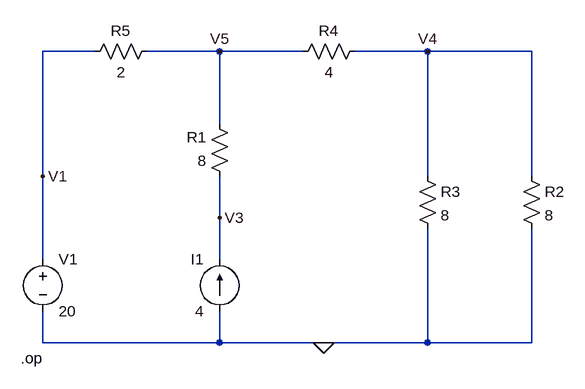
[diagram p0: schematic T2.asc]
T2.asc, the LTspice schematic file:
Version 4
SHEET 1 1048 680
WIRE 0 48 -80 48
WIRE 192 48 80 48
WIRE 320 48 192 48
WIRE 512 48 400 48
WIRE 672 48 512 48
WIRE 192 160 192 48
WIRE -80 240 -80 48
WIRE 512 240 512 48
WIRE 672 240 672 48
WIRE 192 304 192 240
WIRE -80 368 -80 240
WIRE 192 368 192 304
WIRE -80 496 -80 448
WIRE 192 496 192 448
WIRE 192 496 -80 496
WIRE 352 496 192 496
WIRE 512 496 512 320
WIRE 512 496 352 496
WIRE 672 496 672 320
WIRE 672 496 512 496
FLAG 352 496 0
FLAG 192 304 V3
FLAG 512 48 V4
FLAG 192 48 V5
FLAG -80 240 V1
SYMBOL res 208 256 R180
WINDOW 0 36 76 Left 2
WINDOW 3 36 40 Left 2
SYMATTR InstName R1
SYMATTR Value 8
SYMBOL res 656 224 R0
SYMATTR InstName R2
SYMATTR Value 8
SYMBOL res 496 224 R0
SYMATTR InstName R3
SYMATTR Value 8
SYMBOL res 304 64 R270
WINDOW 0 32 56 VTop 2
WINDOW 3 0 56 VBottom 2
SYMATTR InstName R4
SYMATTR Value 4
SYMBOL voltage -80 352 R0
WINDOW 123 0 0 Left 0
WINDOW 39 0 0 Left 0
SYMATTR InstName V1
SYMATTR Value 20
SYMBOL current 192 448 R180
WINDOW 0 24 80 Left 2
WINDOW 3 24 0 Left 2
WINDOW 123 0 0 Left 0
WINDOW 39 0 0 Left 0
SYMATTR InstName I1
SYMATTR Value 4
SYMBOL res 96 32 R90
WINDOW 0 0 56 VBottom 2
WINDOW 3 32 56 VTop 2
SYMATTR InstName R5
SYMATTR Value 2
TEXT -114 520 Left 2 !.op

The netlist it stands for:
* T2.asc
R1 V3 V5 8
R2 V4 0 8
R3 V4 0 8
R4 V5 V4 4
V1 V1 0 20
I1 0 V3 4
R5 V5 V1 2
.op
.backanno
.end